# EasyEDA Pro project ProPrj_自动人脸识别系统_2026-04-16.epro

# Schematic Schematic1
Assembly Variant: Basic; Board Name: Board1; Create Date: 2026-04-05; Page Name: P1; Project Name: 自动人脸识别系统; Schematic Name: Schematic1; Update Date: 2026-04-05; BladeWidth: 10; Company: 嘉立创EDA; Page Size: A4; RegionStart: 1; ShowBorder: 1; TitleBlock: 1; TitleBlockPosition: 3; Version: V1.0; XRegionCount: 6; YRegionCount: 4
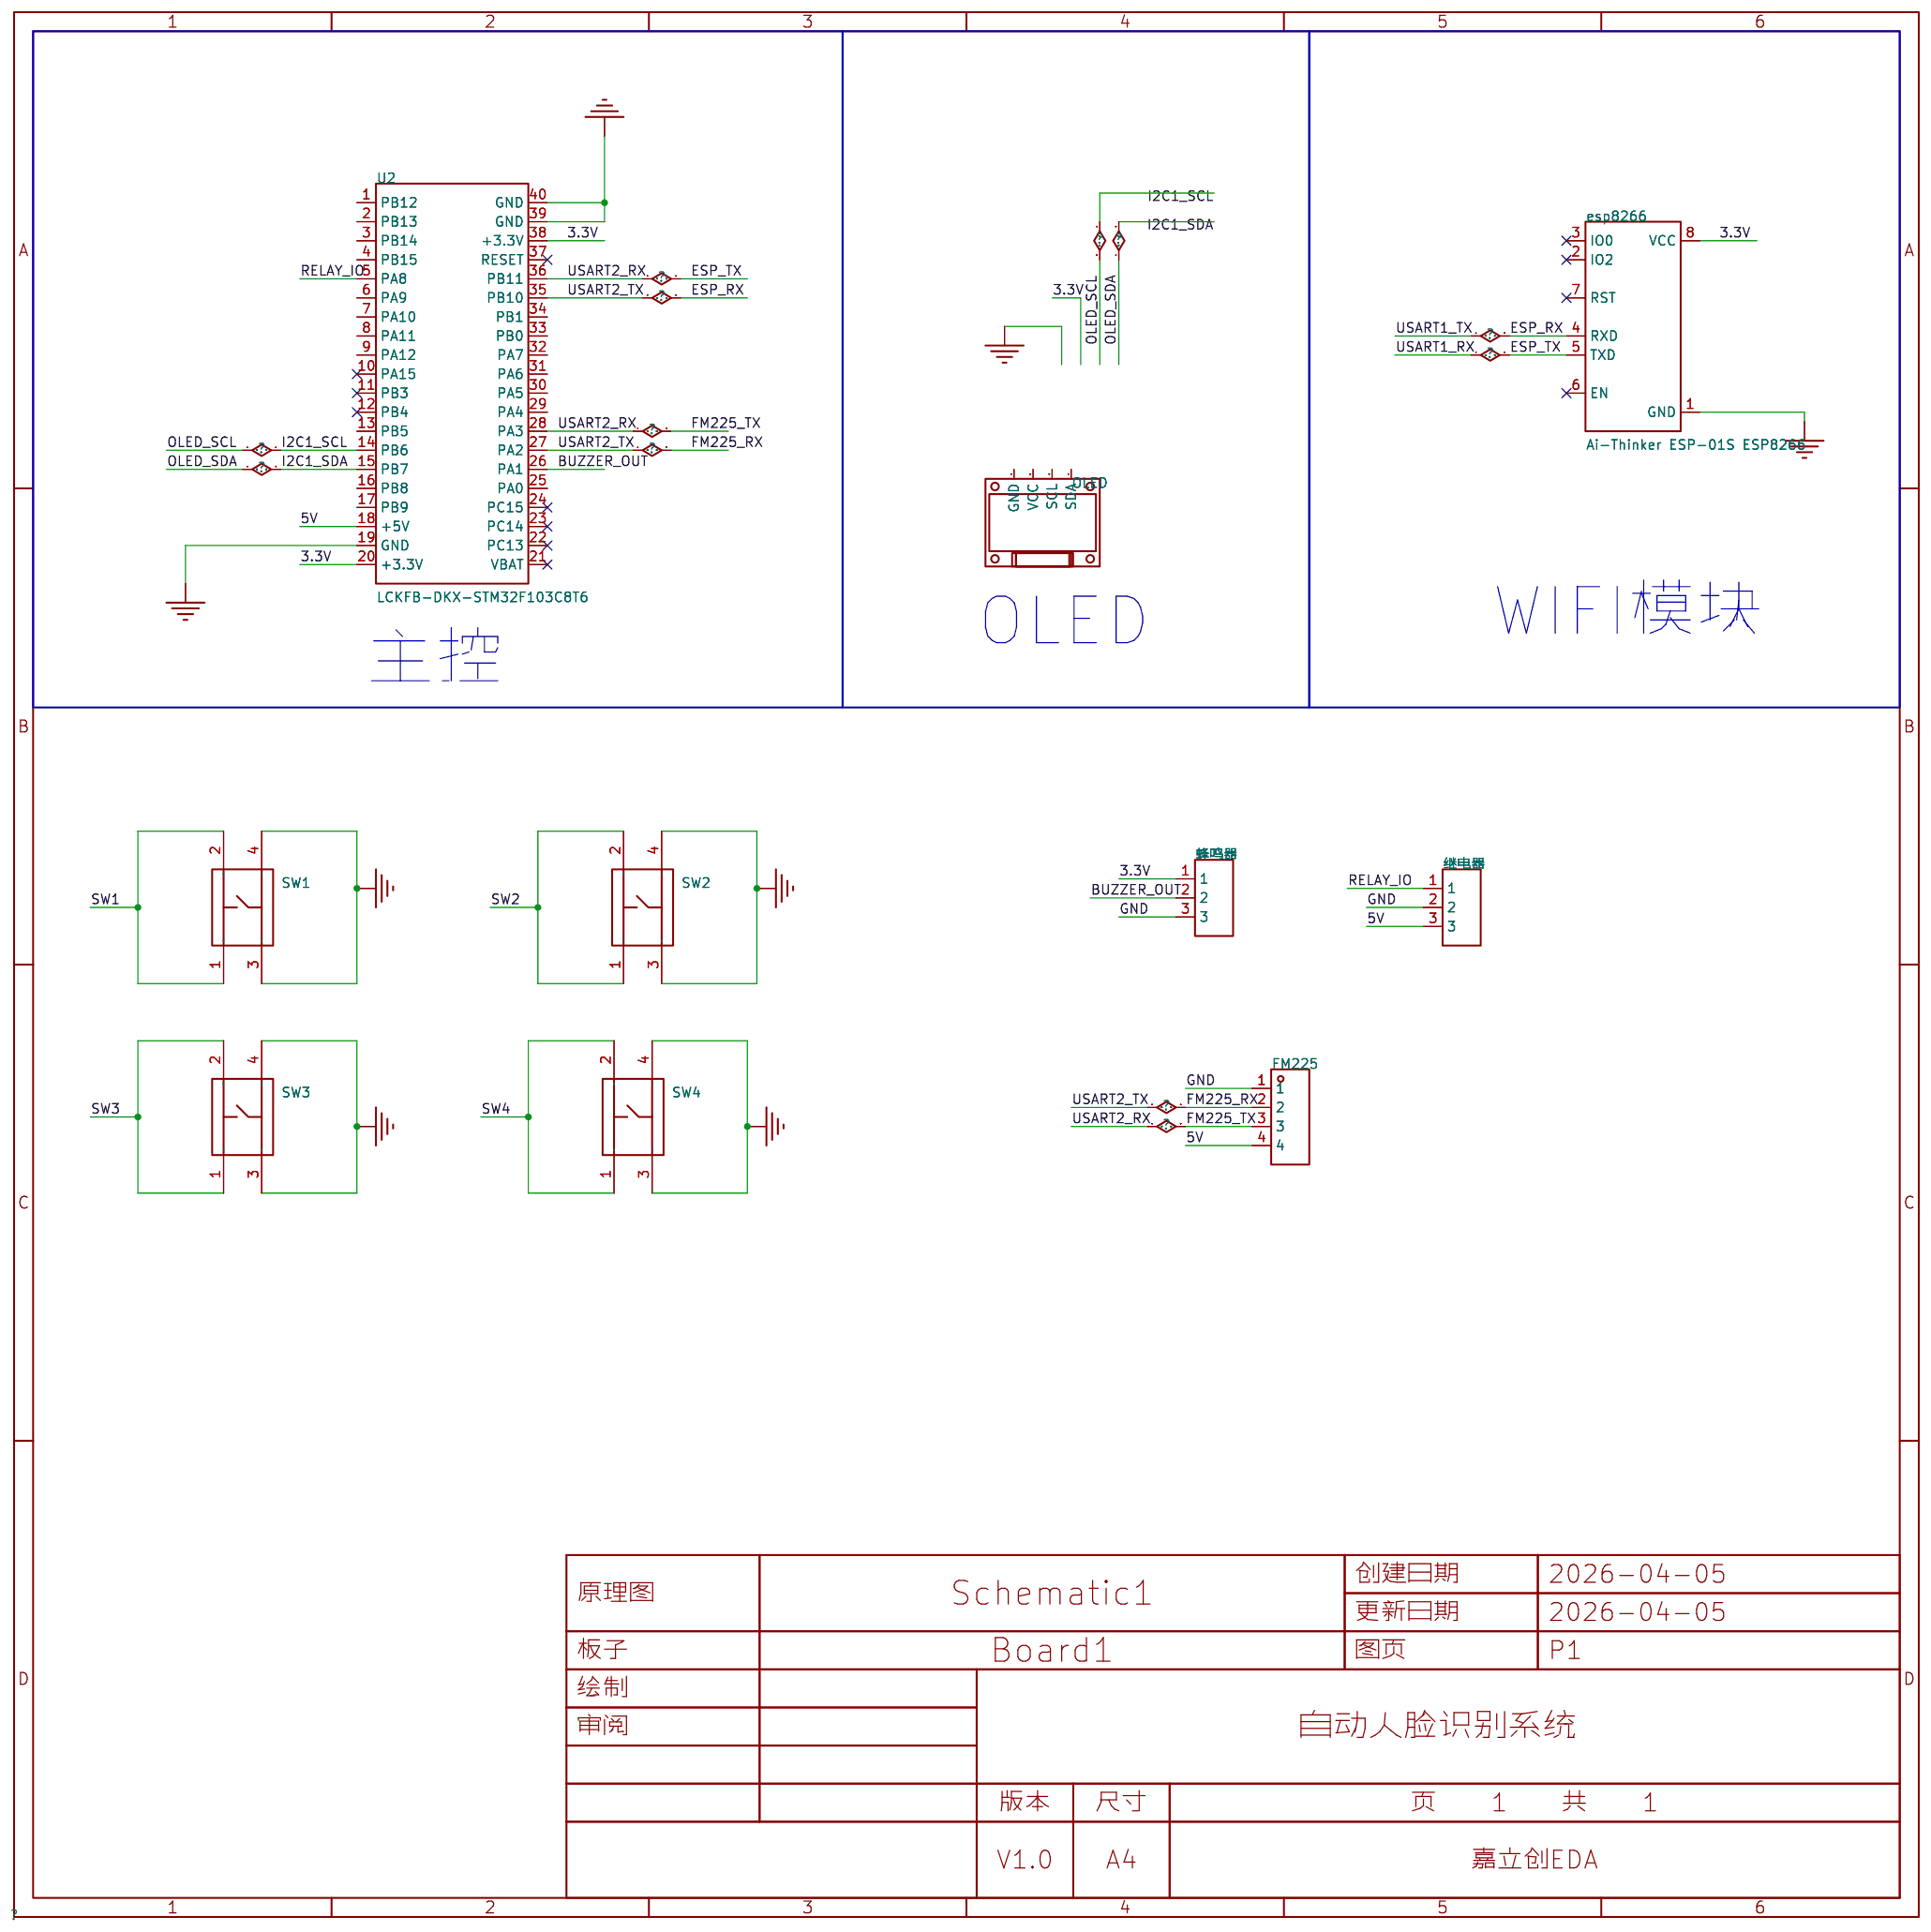
[diagram p0: schematic sheet]

## Parts
esp8266  Ai-Thinker ESP-01S ESP8266  [WIFIM-TH_8P-L24.7-W14.4-P2.54]
FM225  -  [HDR-TH_4P-P2.54-V-F]
OLED  -  [0.96OLED_4P]
SW1  K2-1102DP-C4SW-04  [KEY-TH_4P-L6.0-W6.0-P4.50-LS6.50]
SW2  K2-1102DP-C4SW-04  [KEY-TH_4P-L6.0-W6.0-P4.50-LS6.50]
SW3  K2-1102DP-C4SW-04  [KEY-TH_4P-L6.0-W6.0-P4.50-LS6.50]
SW4  K2-1102DP-C4SW-04  [KEY-TH_4P-L6.0-W6.0-P4.50-LS6.50]
U2  LCKFB-DKX-STM32F103C8T6  [CONN-TH_L53.3-W22.9_STM32F103C8T6-CARD]
继电器  -  [HDR-TH_3P-P2.54-V-F]
蜂鸣器  -  [HDR-TH_3P-P2.54-V-F]

## Library data of the parts
esp8266 = Ai-Thinker ESP-01S ESP8266: Supplier Part: C17606792; Manufacturer: Ai-Thinker(安信可); JLCPCB Part Class: Extended Part; Datasheet: https://item.szlcsc.com/datasheet/Ai-Thinker%2520ESP-01S%2520ESP8266/18736031.html; Supplier: LCSC
FM225 = HDR-F_2.54_1x4P: Supplier Part: C2718488; Supplier Footprint: 插件
OLED = 0.96OLED模块_4P: Supplier Footprint: 插件
SW1-SW4 = K2-1102DP-C4SW-04: 电路结构:单刀单掷;按钮形状:圆形按钮;作用力:2.5N;安装方式:直插;开关长度:6mm;开关宽度:6mm;开关高度:5mm;触点电流:50mA;额定电压:12V;带灯:-;工作寿命:10万次;; LCSC Part Name: 轻触按键开关6*6*5; Supplier Part: C110153; Manufacturer: 韩国韩荣; Supplier Footprint: 插件-4P,6x6mm; JLCPCB Part Class: Extended Part; Datasheet: https://item.szlcsc.com/datasheet/K2-1102DP-C4SW-04/111374.html; Supplier: LCSC; Circuit: 单刀单掷; Actuator Style: 圆形按钮; Operating Force: 2.5N; Mounting Type: 直插; Length: 6mm; Width: 6mm; Switch Height: 5mm; Contact Current: 50mA; Voltage Rating: 12V; Life: 10万次; Operating Temperature: -25℃~+85℃
U2 = LCKFB-DKX-STM32F103C8T6: 搭载Contex M3内核,程序存储容量64KB,RAM总容量20KB,最高72MHz主频,提供高效的计算能力和稳定的运行环境。; LCSC Part Name: 立创·地阔星-STM32F103C8T6开发板; Supplier Part: C22396880; Manufacturer: 立创开发板; JLCPCB Part Class: Extended Part; Datasheet: https://item.szlcsc.com/datasheet/LCKFB-DKX-STM32F103C8T6/24005615.html; Supplier: LCSC
继电器 蜂鸣器 = HDR-F_2.54_1x3P: Supplier Part: C541850; Supplier Footprint: 插件

## Nets
3.3V: esp8266.8(VCC) U2.20(+3.3V) U2.38(+3.3V) 蜂鸣器.1
5V: FM225.4 U2.18(+5V) 继电器.3
GND: esp8266.1(GND) FM225.1 SW1.3 SW1.4 SW2.3 SW2.4 SW3.3 SW3.4 SW4.3 SW4.4 U2.19(GND) U2.39(GND) U2.40(GND) 继电器.2 蜂鸣器.3
BUZZER_OUT: U2.26(PA1) 蜂鸣器.2
ESP_RX: esp8266.4(RXD) FM225.2 U2.27(PA2) U2.35(PB10)
ESP_TX: esp8266.5(TXD) FM225.3 U2.28(PA3) U2.36(PB11)
I2C1_SCL: U2.14(PB6)
I2C1_SDA: U2.15(PB7)
RELAY_IO: U2.5(PA8) 继电器.1
SW1: SW1.1 SW1.2
SW2: SW2.1 SW2.2
SW3: SW3.1 SW3.2
SW4: SW4.1 SW4.2

Not connected (* = marked no-connect by the designer): esp8266 2(IO2)* 3(IO0)* 6(EN)* 7(RST)*; OLED 1(GND) 2(VCC) 3(SCL) 4(SDA); U2 1(PB12) 2(PB13) 3(PB14) 4(PB15) 6(PA9) 7(PA10) 8(PA11) 9(PA12) 10(PA15)* 11(PB3)* 12(PB4)* 13(PB5) 16(PB8) 17(PB9) 21(VBAT)* 22(PC13)* 23(PC14)* 24(PC15)* 25(PA0) 29(PA4) 30(PA5) 31(PA6) 32(PA7) 33(PB0) 34(PB1) 37(RESET)*

## Notes on the sheet
- OLED
- WIFI模块
- 主控

# Board PCB1
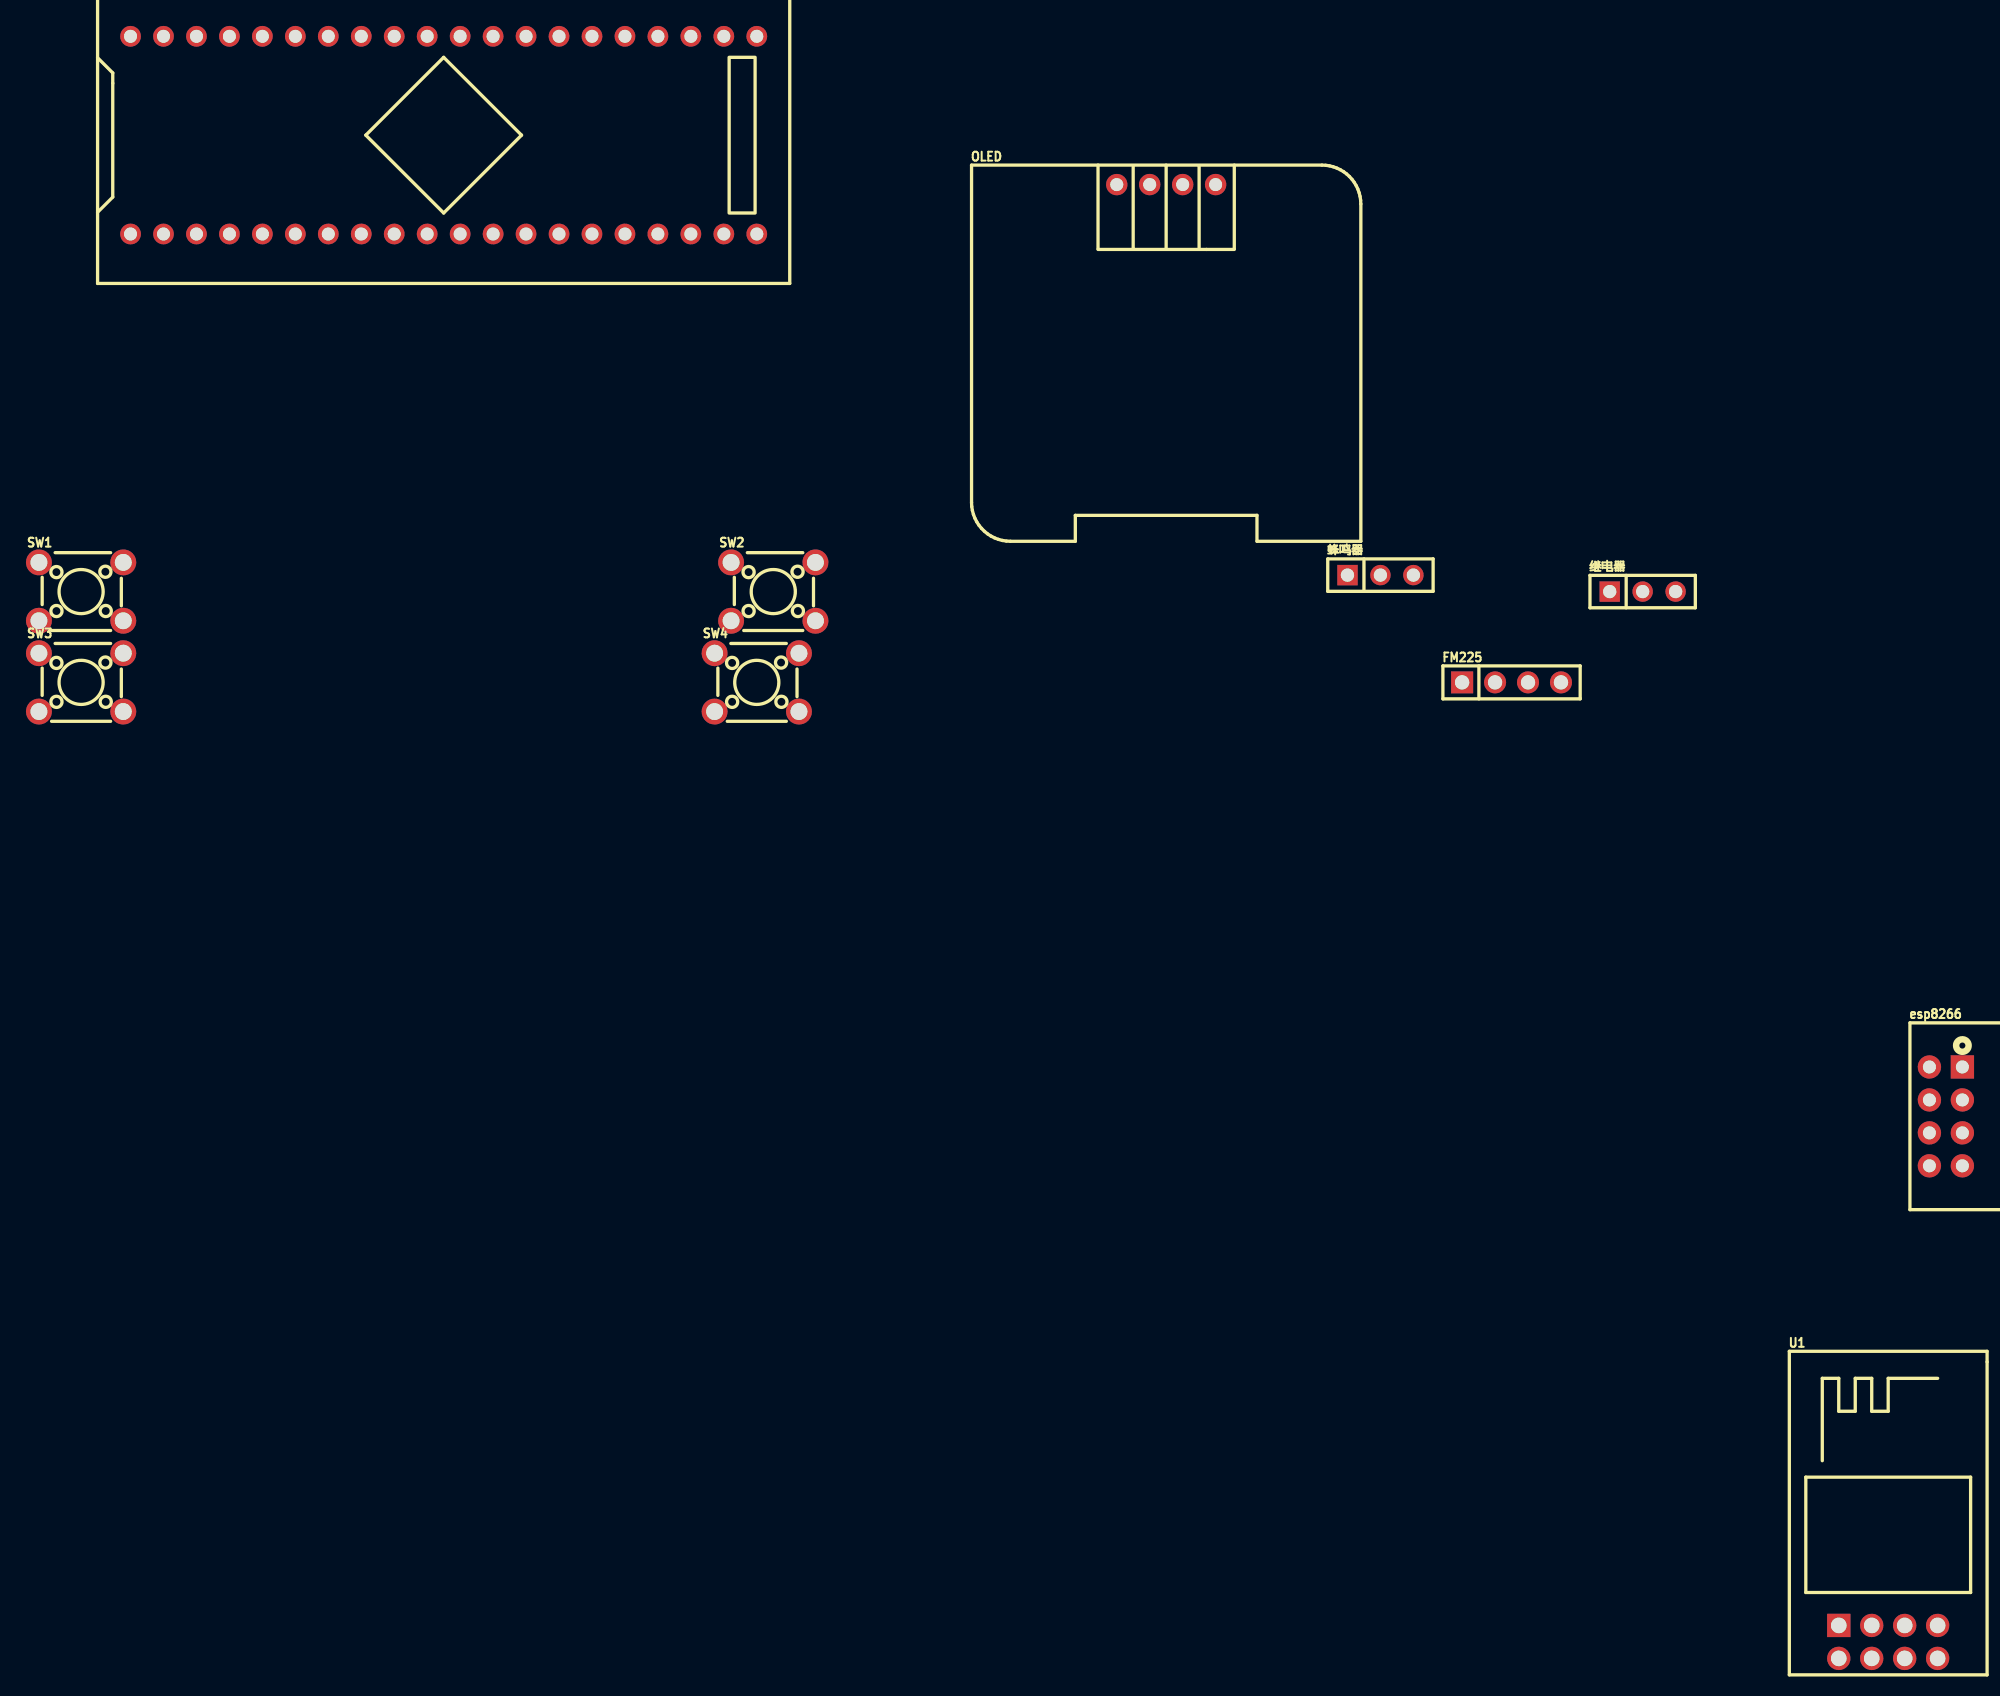
[diagram p1: board, top side]
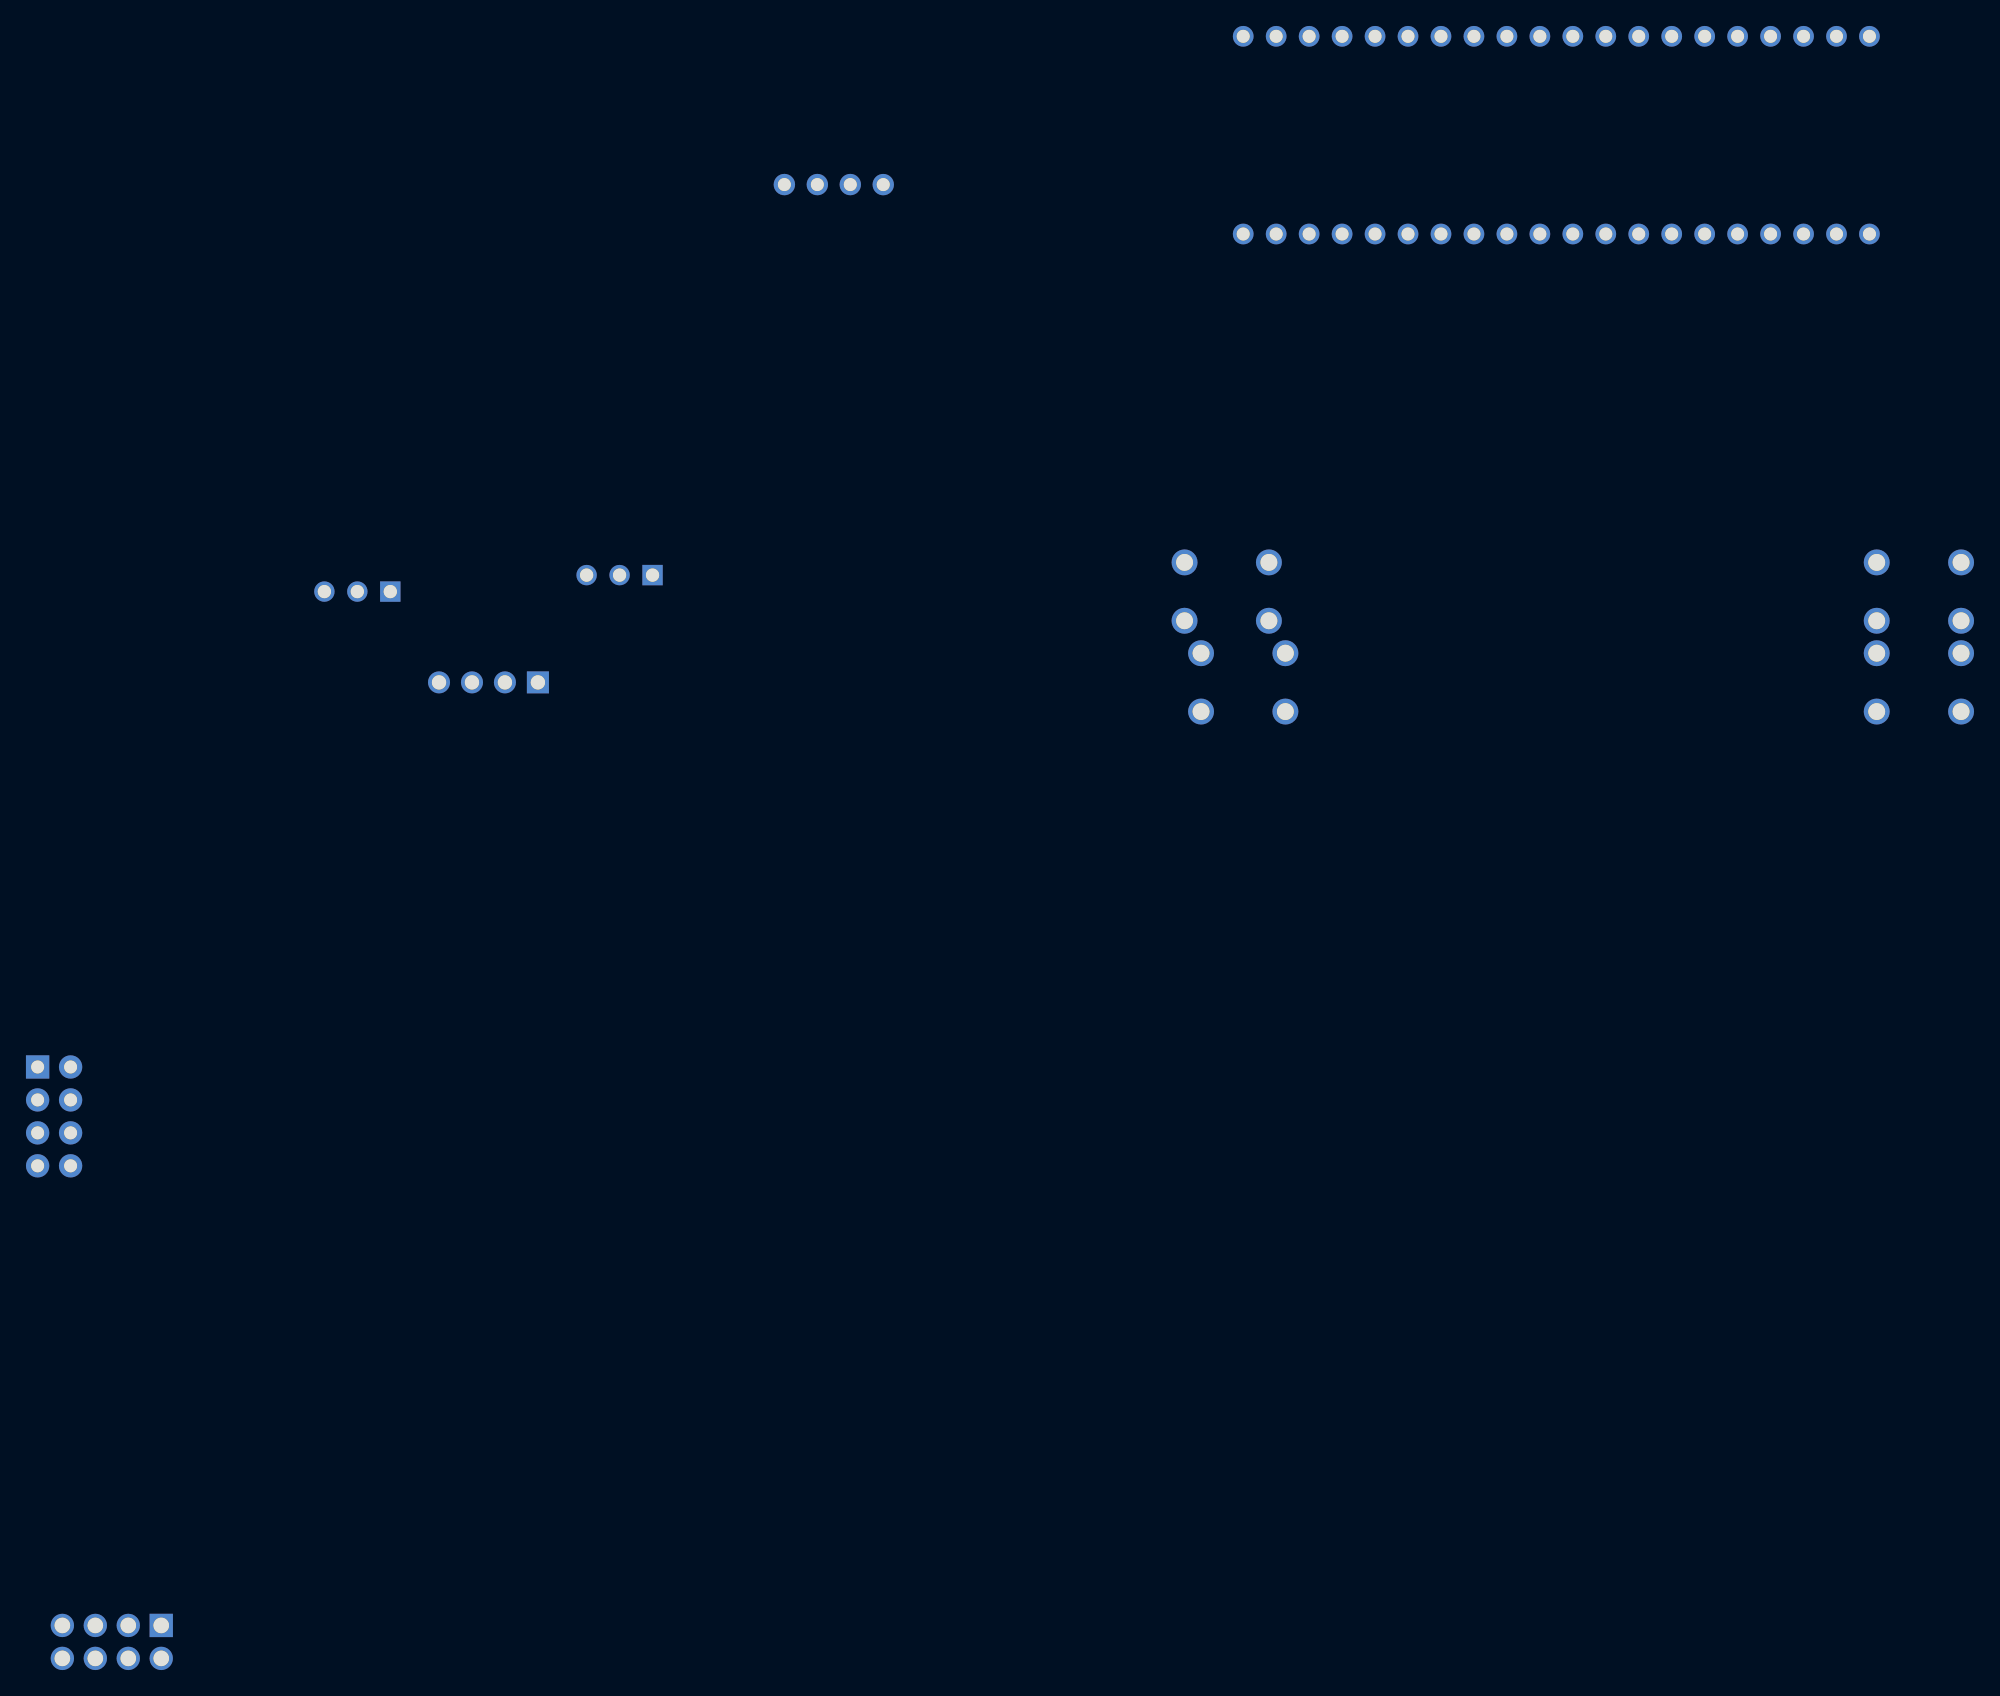
[diagram p2: board, bottom side, seen from below]

No outline. copper layers: Top Layer, Bottom Layer. Coordinates in mm from the lowest, leftmost part position.
Stack: Top Layer 0.035mm / Dielectric1 1.51mm FR4 er 4.5 / Bottom Layer 0.035mm

## Design rules (mm)
spacing copperThickness1oz (default): track to track 0.102, other pairs 0.152 to 0.3
spacing copperThickness2oz: track to track 0.203, other pairs 0.152 to 0.3
track width copperThickness1oz (default): min 0.127, default 0.254, max 2.54
track width copperThickness2oz: min 0.203, default 0.254, max 2.54
differential pair differentialPair (default): width min 0.127, default 0.254, max 2.54; gap min 0.152, default 0.152

## Placement (name value [footprint] x y rotation side)
esp8266  Ai-Thinker ESP-01S ESP8266  [WIFIM-TH_8P-L24.7-W14.4-P2.54]  143.7 40.51 0 top
FM225  -  [HDR-TH_4P-P2.54-V-F]  110.23 73.97 0 top
OLED  -  [0.96OLED_4P]  83.62 112.35 0 top
SW1  K2-1102DP-C4SW-04  [KEY-TH_4P-L6.0-W6.0-P4.50-LS6.50]  0 80.97 0 top
SW2  K2-1102DP-C4SW-04  [KEY-TH_4P-L6.0-W6.0-P4.50-LS6.50]  53.34 80.97 0 top
SW3  K2-1102DP-C4SW-04  [KEY-TH_4P-L6.0-W6.0-P4.50-LS6.50]  0 73.97 0 top
SW4  K2-1102DP-C4SW-04  [KEY-TH_4P-L6.0-W6.0-P4.50-LS6.50]  52.07 73.97 0 top
U1  ESP-01S  [WIFIM-TH_ESP-01S]  139.26 0 0 top
U2  LCKFB-DKX-STM32F103C8T6  [CONN-TH_L53.3-W22.9_STM32F103C8T6-CARD]  27.94 116.16 0 top
继电器  -  [HDR-TH_3P-P2.54-V-F]  120.34 80.97 0 top
蜂鸣器  -  [HDR-TH_3P-P2.54-V-F]  100.13 82.24 0 top

## Footprints (pads in the part's own frame, mm; a bottom-side part is the same pattern mirrored in y, then rotated)
0.96OLED_4P
  round 1.65 hole 1: 1(-3.81,-0.002) 2(-1.27,0.002) 3(1.27,0.002) 4(3.81,0.002)
CONN-TH_L53.3-W22.9_STM32F103C8T6-CARD
  round 1.6 hole 1: 1(-24.13,-7.62) 2(-21.59,-7.62) 3(-19.05,-7.62) 4(-16.51,-7.62) 5(-13.97,-7.62) 6(-11.43,-7.62) 7(-8.89,-7.62) 8(-6.35,-7.62) 9(-3.81,-7.62) 10(-1.27,-7.62) 11(1.27,-7.62) 12(3.81,-7.62) 13(6.35,-7.62) 14(8.89,-7.62) 15(11.43,-7.62) 16(13.97,-7.62) 17(16.51,-7.62) 18(19.05,-7.62) 19(21.59,-7.62) 20(24.13,-7.62) 21(24.13,7.62) 22(21.59,7.62) 23(19.05,7.62) 24(16.51,7.62) 25(13.97,7.62) 26(11.43,7.62) 27(8.89,7.62) 28(6.35,7.62) 29(3.81,7.62) 30(1.27,7.62) 31(-1.27,7.62) 32(-3.81,7.62) 33(-6.35,7.62) 34(-8.89,7.62) 35(-11.43,7.62) 36(-13.97,7.62) 37(-16.51,7.62) 38(-19.05,7.62) 39(-21.59,7.62) 40(-24.13,7.62)
HDR-TH_3P-P2.54-V-F
  rect 1.575x1.575 hole 1.02: 1(-2.54,0)
  round 1.575 hole 1.02: 2(0,0) 3(2.54,0)
HDR-TH_4P-P2.54-V-F
  rect 1.7x1.7 hole 1.1: 1(-3.81,0)
  round 1.7 hole 1.1: 2(-1.27,0) 3(1.27,0) 4(3.81,0)
KEY-TH_4P-L6.0-W6.0-P4.50-LS6.50
  round 2 hole 1.3: 1(-3.25,2.25) 2(3.25,2.25) 3(-3.25,-2.25) 4(3.25,-2.25)
WIFIM-TH_8P-L24.7-W14.4-P2.54
  rect 1.8x1.8 hole 1: 1(1.27,3.81)
  round 1.8 hole 1: 2(1.27,1.27) 3(1.27,-1.27) 4(1.27,-3.81) 5(-1.27,3.81) 6(-1.27,1.27) 7(-1.27,-1.27) 8(-1.27,-3.81)
WIFIM-TH_ESP-01S
  rect 1.8x1.8 hole 1.2: 1(-3.81,1.27)
  round 1.8 hole 1.2: 2(-1.27,1.27) 3(1.27,1.27) 4(3.81,1.27) 5(3.81,-1.27) 6(1.27,-1.27) 7(-1.27,-1.27) 8(-3.81,-1.27)

## Nets
3.3V: esp8266.8 OLED.2 U2.20 U2.38 蜂鸣器.1
5V: FM225.4 U2.18 继电器.3
GND: esp8266.1 FM225.1 OLED.1 SW1.3 SW1.4 SW2.3 SW2.4 SW3.3 SW3.4 SW4.3 SW4.4 U2.19 U2.39 U2.40 继电器.2 蜂鸣器.3
BUZZER_OUT: U2.26 蜂鸣器.2
ESP_RX: esp8266.4 FM225.2 U2.27 U2.35
ESP_TX: esp8266.5 FM225.3 U2.28 U2.36
I2C1_SCL: OLED.3 U2.14
I2C1_SDA: OLED.4 U2.15
RELAY_IO: 继电器.1
SW1: SW1.1 SW1.2
SW2: SW2.1 SW2.2
SW3: SW3.1 SW3.2
SW4: SW4.1 SW4.2

Pads without a net: esp8266 2 3 6 7; U1 1 2 3 4 5 6 7 8; U2 1 2 3 4 5 6 7 8 9 10 11 12 13 16 17 21 22 23 24 25 29 30 31 32 33 34 37
